# Altium project IdealDiodeOR.PrjPCB
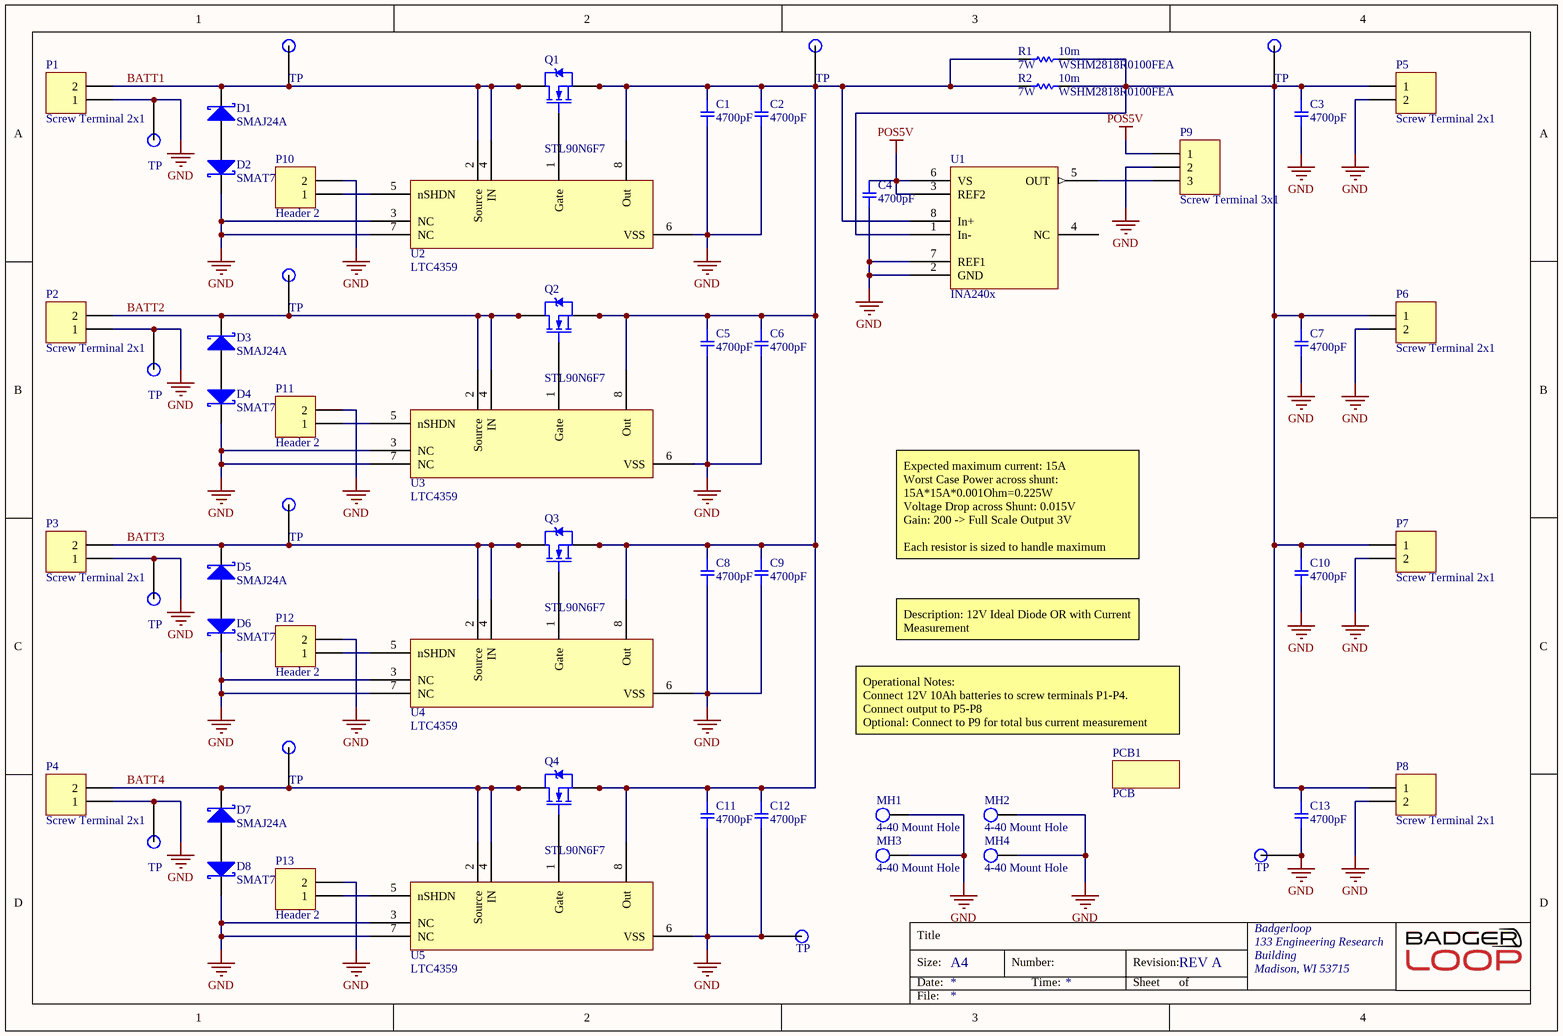
[diagram p0: idealdiodeOR.SchDoc]
Designer: R. Castle; Engineer: R. Castle; Part_Number: P4_EL_LV_001_IdealDiodeRevA; Revision: REV A
1 sheet, 62 parts. Net scope: global (net labels, ports and power ports of the same name join across sheets).
Board file: idealdiodeOR.PcbDoc

## Sheet idealdiodeOR.SchDoc
size A4; Organization: Badgerloop; Address1: 133 Engineering Research; Address2: Building; Address3: Madison, WI 53715

### Parts
C1  4700pF  [SMD-1206C]
C2  4700pF  [SMD-1206C]
C3  4700pF  [SMD-1206C]
C4  4700pF  [SMD-1206C]
C5  4700pF  [SMD-1206C]
C6  4700pF  [SMD-1206C]
C7  4700pF  [SMD-1206C]
C8  4700pF  [SMD-1206C]
C9  4700pF  [SMD-1206C]
C10  4700pF  [SMD-1206C]
C11  4700pF  [SMD-1206C]
C12  4700pF  [SMD-1206C]
C13  4700pF  [SMD-1206C]
D1  SMAJ24A  [INDM5026X18N]
D2  SMAT70A  [SMAT70A]
D3  SMAJ24A  [INDM5026X18N]
D4  SMAT70A  [SMAT70A]
D5  SMAJ24A  [INDM5026X18N]
D6  SMAT70A  [SMAT70A]
D7  SMAJ24A  [INDM5026X18N]
D8  SMAT70A  [SMAT70A]
MH1  4-40 Mount Hole  [MH]
MH2  4-40 Mount Hole  [MH]
MH3  4-40 Mount Hole  [MH]
MH4  4-40 Mount Hole  [MH]
P1  Screw Terminal 2x1  [2POS TERM BLOCK]
P2  Screw Terminal 2x1  [2POS TERM BLOCK]
P3  Screw Terminal 2x1  [2POS TERM BLOCK]
P4  Screw Terminal 2x1  [2POS TERM BLOCK]
P5  Screw Terminal 2x1  [2POS TERM BLOCK]
P6  Screw Terminal 2x1  [2POS TERM BLOCK]
P7  Screw Terminal 2x1  [2POS TERM BLOCK]
P8  Screw Terminal 2x1  [2POS TERM BLOCK]
P9  Screw Terminal 3x1  [3POS TERM BLOCK]
P10  Header 2  [Pin Header 1x2 TH Pitch 2.54mm]
P11  Header 2  [Pin Header 1x2 TH Pitch 2.54mm]
P12  Header 2  [Pin Header 1x2 TH Pitch 2.54mm]
P13  Header 2  [Pin Header 1x2 TH Pitch 2.54mm]
PCB1  PCB  [PCB]
Q1  STL90N6F7  [DPAK228P991X238-4N]
Q2  STL90N6F7  [DPAK228P991X238-4N]
Q3  STL90N6F7  [DPAK228P991X238-4N]
Q4  STL90N6F7  [DPAK228P991X238-4N]
R1  WSHM2818R0100FEA  Resistance: 10m  Power Rating: 7W  [CAPMP7146X15N]
R2  WSHM2818R0100FEA  Resistance: 10m  Power Rating: 7W  [CAPMP7146X15N]
TP1  TP  [Test Point]
TP2  TP  [Test Point]
TP3  TP  [Test Point]
TP4  TP  [Test Point]
TP5  TP  [Test Point]
TP6  TP  [Test Point]
TP7  TP  [Test Point]
TP8  TP  [Test Point]
TP9  TP  [Test Point]
TP10  TP  [Test Point]
TP11  TP  [Test Point]
TP12  TP  [Test Point]
U1  INA240x  [SOIC127P600X175-8N]
U2  LTC4359  [8SOP]
U3  LTC4359  [8SOP]
U4  LTC4359  [8SOP]
U5  LTC4359  [8SOP]

### Nets
GND: C1.2 C2.2 C3.2 C4.2 C5.2 C6.2 C7.2 C8.2 C9.2 C10.2 C11.2 C12.2 C13.2 D2.2(K) D4.2(K) D6.2(K) D8.2(K) MH1.2 MH2.2 MH3.2 MH4.2 P1.1 P2.1 P3.1 P4.1 P5.2 P6.2 P7.2 P8.2 P9.2 P10.2 P11.2 P12.2 P13.2 TP3.1 TP5.1 TP7.1 TP9.1 TP10.1 TP12.1 U1.2(GND) U1.7(REF1) U2.3(NC) U2.6(VSS) U2.7(NC) U3.3(NC) U3.6(VSS) U3.7(NC) U4.3(NC) U4.6(VSS) U4.7(NC) U5.3(NC) U5.6(VSS) U5.7(NC)
POS5V: C4.1 P9.1 U1.3(REF2) U1.6(VS)
BATT1: D1.1(A) P1.2 Q1.5(D) Q1.6(D) Q1.7(D) Q1.8(D) TP1.1 U2.2(Source) U2.4(IN)
BATT2: D3.1(A) P2.2 Q2.5(D) Q2.6(D) Q2.7(D) Q2.8(D) TP4.1 U3.2(Source) U3.4(IN)
BATT3: D5.1(A) P3.2 Q3.5(D) Q3.6(D) Q3.7(D) Q3.8(D) TP6.1 U4.2(Source) U4.4(IN)
BATT4: D7.1(A) P4.2 Q4.5(D) Q4.6(D) Q4.7(D) Q4.8(D) TP8.1 U5.2(Source) U5.4(IN)
NetC1_1: C1.1 C2.1 C5.1 C6.1 C8.1 C9.1 C11.1 C12.1 Q1.1(S) Q1.2(S) Q1.3(S) Q2.1(S) Q2.2(S) Q2.3(S) Q3.1(S) Q3.2(S) Q3.3(S) Q4.1(S) Q4.2(S) Q4.3(S) R1.1 R2.1 TP2.1 U1.8(In+) U2.8(Out) U3.8(Out) U4.8(Out) U5.8(Out)
NetC3_1: C3.1 C7.1 C10.1 C13.1 P5.1 P6.1 P7.1 P8.1 R1.2 R2.2 TP11.1 U1.1(In-)
NetD1_2: D1.2(K) D2.1(A)
NetD3_2: D3.2(K) D4.1(A)
NetD5_2: D5.2(K) D6.1(A)
NetD7_2: D7.2(K) D8.1(A)
NetP9_3: P9.3 U1.5(OUT)
NetP10_1: P10.1 U2.5(nSHDN)
NetP11_1: P11.1 U3.5(nSHDN)
NetP12_1: P12.1 U4.5(nSHDN)
NetP13_1: P13.1 U5.5(nSHDN)
NetQ1_4: Q1.4(G) U2.1(Gate)
NetQ2_4: Q2.4(G) U3.1(Gate)
NetQ3_4: Q3.4(G) U4.1(Gate)
NetQ4_4: Q4.4(G) U5.1(Gate)

Not connected (* = marked no-connect by the designer): U1 4(NC)

### Notes on the sheet
- Expected maximum current: 15A
  Worst Case Power across shunt: 15A*15A*0.001Ohm=0.225W
  Voltage Drop across Shunt: 0.015V
  Gain: 200 -> Full Scale Output 3V
  Each resistor is sized to handle maximum current
- Description: 12V Ideal Diode OR with Current Measurement
- Operational Notes:
  Connect 12V 10Ah batteries to screw terminals P1-P4.
  Connect output to P5-P8
  Optional: Connect to P9 for total bus current measurement
- Title
- Size:
- Date:
- A4
- Number:
- Time:
- Revision:
- Sheet
- of
- File:

### Library data of the parts
C1-C13 = GCJ31BR72J472KXJ1L: CAP CER 4700PF 630V X7R 1206; Manufacturer: Murata Electronics North America; Factory Stock: 0; Unit Price (USD): 0.48; Minimum Quantity: 1; Tolerance: ±10%; Datasheets: http://www.murata.com/~/media/webrenewal/support/library/catalog/products/capacitor/mlcc/c03e.ashx; Image: //media.digikey.com/Renders/Murata%20Renders/GR331BD72E473KW01L.jpg; Digikey P/N: 490-5610-1-ND; Part Number: GCJ31BR72J472KXJ1L; Quantity Available: 6697; @ qty: 0; Packaging: Cut Tape (CT); Series: GCJ; Part Status: Active; Value: 4700pF; Voltage: 630V; Temperature Coefficient: X7R; Operating Temperature: -55°C ~ 125°C; Features: Soft Termination; Ratings: AEC-Q200; Applications: Automotive, Boardflex Sensitive; Mounting Type: Surface Mount, MLCC; Package / Case: 1206 (3216 Metric); Size / Dimension: 0.126" L x 0.063" W (3.20mm x 1.60mm); Height - Seated (Max): -; Thickness (Max): 0.049" (1.25mm); Lead Spacing: -; Lead Style: -
D1 D3 D5 D7 = SMAJ24A: TVS DIODE 24V 38.9V DO214AC; Manufacturer: LittelFuse Inc; Digikey P/N: SMAJ24ALFCT-ND; Digikey Link: https://www.digikey.com/product-detail/en/littelfuse-inc/SMAJ24A/SMAJ24ALFCT-ND/762500; Manufacturer P/N: SMAJ24A
D2 D4 D6 D8 = SMAT70A: TVS DIODE 70V 100V SMA; Manufacturer: Diodes Incorporated; Manufacturer P/N: SMAT70A-13-F; Digikey P/N: SMAT70A-FDICT-ND; Digikey Link: https://www.digikey.com/product-detail/en/diodes-incorporated/SMAT70A-13-F/SMAT70A-FDICT-ND/804910
P1-P8 = Screw Terminal 2x1: Screw Terminal, 2-Pin
P9 = Screw Terminal 3x1: Screw Terminal, 3-Pin; LatestRevisionDate: 17-Jul-2002; LatestRevisionNote: Re-released for DXP Platform.; Publisher: Altium Limited
P10-P13 = Header 2: Header, 2-Pin; LatestRevisionDate: 17-Jul-2002; LatestRevisionNote: Re-released for DXP Platform.; Publisher: Altium Limited
Q1-Q4 = STL90N6F7: MOSFET N-CH 60V 90A F7 8PWRFLAT; Manufacturer: 497-15913-2-ND; Digikey Link: https://www.digikey.com/product-detail/en/stmicroelectronics/STL90N6F7/497-15913-1-ND/5357115; Digikey P/N: 497-15913-2-ND; Manufacturer P/N: STL90N6F7
R1 R2 = WSHM2818R0100FEA: RES 0.01 OHM 1% 7W 2818; Manufacturer: Vishay Dale; Digikey P/N: 541-2626-1-ND; Digikey Link: https://www.digikey.com/product-detail/en/vishay-dale/WSHM2818R0100FEA/541-2626-1-ND/5419333; Manufacturer P/N: WSHM2818R0100FEA
U1 = INA240x: IC AMP CURRENT SENSE 8-TSSOP; Manufacturer: TI; Manufacturer P/N: INA240A1PWR; Digikey P/N: 296-45088-1-ND; Digikey Link: https://www.digikey.com/product-detail/en/texas-instruments/INA240A1PWR/296-45088-1-ND/6562101
U2-U5 = LTC4359: IC OR CTRLR N+1 8MSOP; Manufacturer: Analog Devices; Manufacturer P/N: LTC4359; Digikey Link: https://www.digikey.com/product-detail/en/linear-technology-analog-devices/LTC4359HMS8-TRPBF/LTC4359HMS8-TRPBFCT-ND/8275335; Digikey P/N: LTC4359HMS8#TRPBFCT-ND